# Altium schematic sheet power2.SchDoc
size A
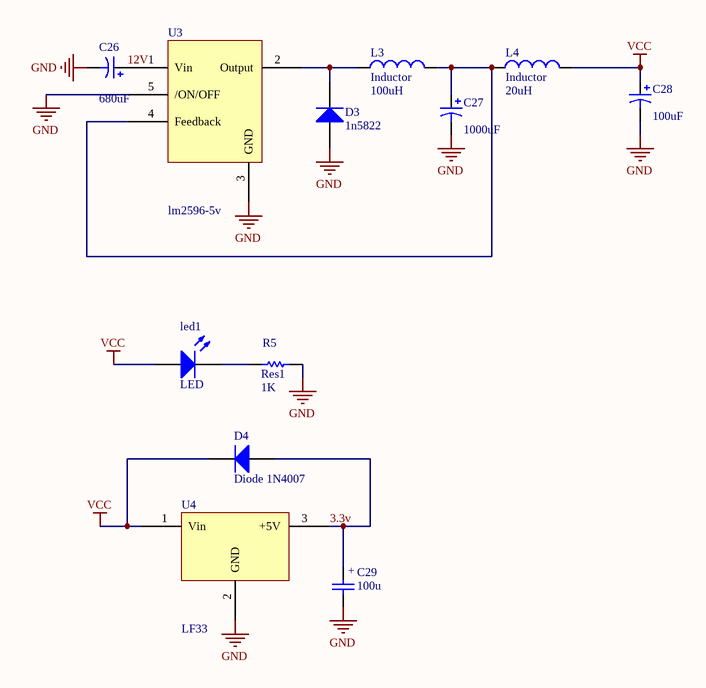
[diagram p0: power2.SchDoc]

## Parts
C26  value 680uF  [CAP ALUM 10.3MM]
C27  value 1000uF  [CAP ALUM 10.3MM]
C28  value 100uF  [CAP ALUM 6.6MM]
C29  value 100u  [CAP ALUM 6.6MM]  (hidden comment: Cap)
D3  1n5822  [DO214AC SMA]
D4  Diode 1N4007  [DO214AC SMA]
L3  Inductor  value 100uH  [inductor - 12x12x7]
L4  Inductor  value 20uH  [inductor - 12x12x7]
led1  LED  [LED 1206/3216 RED]
R5  Res1  value 1K  [RES 1206/3216]
U3  lm2596-5v  [DPAK170P1430X238-6N]
U4  LF33  [REG-7805-WALL]

## Nets
GND: C26.2 C27.2 C28.2 C29.- D3.1(A) R5.2 U3.3(GND) U3.5(/ON/OFF) U4.2(GND)
VCC: C28.1 D4.2(K) L4.2 led1.A U4.1(Vin)
3.3v: C29.+ D4.1(A) U4.3(+5V)
12V: C26.1 U3.1(Vin)
NetC27_1: C27.1 L3.2 L4.1 U3.4(Feedback)
NetD3_2: D3.2(K) L3.1 U3.2(Output)
Netled1_K: led1.K R5.1

## Library data of the parts
C26-C28 = Cap Pol1: Polarized Capacitor (Radial); Published: 8-Jun-2000; LatestRevisionDate: 17-Jul-2002; LatestRevisionNote: Re-released for DXP Platform.; PackageReference: RB7.6-15; Publisher: Altium Limited; PackageDescription: Polarized Capacitor (Radial); 2 Leads
C29 = Cap Pol: CAP-3300Uf; pin to pad: +>1 ->2
D3 D4 = Diode 1N4007: 1 Amp General Purpose Rectifier; Published: 8-Jun-2000; LatestRevisionDate: 17-Jul-2002; LatestRevisionNote: Re-released for DXP Platform.; DatasheetVersion: 1998; PackageVersion: Aug-1999; PackageReference: DO-41; Publisher: Altium Limited; PackageDescription: Diode, Axial; Body 5.2 x 2.7 mm (LxDia. max), Lead Dia. 0.86 mm (max); Code_JEDEC: DO-204-AL; ComponentLink1Description: Manufacturer Link; ComponentLink1URL: http://www.fairchildsemi.com/; ComponentLink2Description: Datasheet; ComponentLink2URL: http://www.fairchildsemi.com/ds/1N%2F1N4001.pdf
L3 L4 = Inductor: Code_IEC: 1005; Published: 8-Jun-2000; LatestRevisionDate: 29-May-2009; LatestRevisionNote: IPC-7351 Footprint Added.; PackageReference: 0402-A; Publisher: Altium Limited; PackageDescription: Chip Inductor; Code_JEITA: 0402
led1 = LED: Typical INFRARED GaAs LED; pin to pad: A>1 K>2; Published: 8-Jun-2000; LatestRevisionDate: 08-Jul-2005; LatestRevisionNote: Mech Layer 1 removed.; Publisher: Altium Limited
R5 = Res1: Resistor; Published: 8-Jun-2000; LatestRevisionDate: 17-Jul-2002; LatestRevisionNote: Re-released for DXP Platform.; PackageReference: AXIAL-0.3; Publisher: Altium Limited; PackageDescription: Axial Device, Thru-Hole; 2 Leads; 0.3 in Pin Spacing
U3 = lm2596
U4 = 7805: Regulator